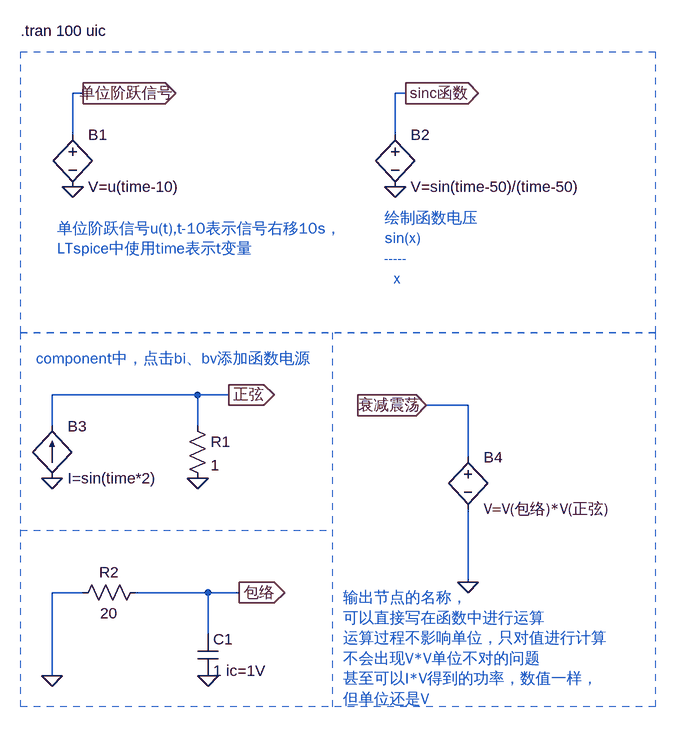
[diagram p0: schematic 08.BVBI函数电源.asc]
08.BVBI函数电源.asc, the LTspice schematic file:
Version 4
SHEET 1 880 1300
WIRE -224 352 -240 352
WIRE 272 352 256 352
WIRE -240 416 -240 352
WIRE 256 416 256 352
WIRE -48 816 -272 816
WIRE 0 816 -48 816
WIRE 368 832 304 832
WIRE -272 864 -272 816
WIRE -48 864 -48 816
WIRE 368 912 368 832
WIRE 368 1104 368 992
WIRE -224 1120 -272 1120
WIRE -32 1120 -144 1120
WIRE 16 1120 -32 1120
WIRE -32 1184 -32 1120
WIRE -272 1248 -272 1120
FLAG -240 496 0
FLAG -224 352 单位阶跃信号
IOPIN -224 352 Out
FLAG 256 496 0
FLAG 272 352 sinc函数
IOPIN 272 352 Out
FLAG -272 944 0
FLAG -48 944 0
FLAG 0 816 正弦
IOPIN 0 816 Out
FLAG -32 1248 0
FLAG -272 1248 0
FLAG 16 1120 包络
IOPIN 16 1120 Out
FLAG 304 832 衰减震荡
IOPIN 304 832 In
FLAG 368 1104 0
SYMBOL bv -240 400 R0
SYMATTR InstName B1
SYMATTR Value V=u(time-10)
SYMBOL bv 256 400 R0
SYMATTR InstName B2
SYMATTR Value V=sin(time-50)/(time-50)
SYMBOL bv 368 896 R0
SYMATTR InstName B4
SYMATTR Value V=V(包络)*V(正弦)
SYMBOL res -64 848 R0
SYMATTR InstName R1
SYMATTR Value 1
SYMBOL cap -48 1184 R0
SYMATTR InstName C1
SYMATTR Value 1 ic=1V
SYMBOL res -128 1104 R90
WINDOW 0 0 56 VBottom 2
WINDOW 3 32 56 VTop 2
SYMATTR InstName R2
SYMATTR Value 20
SYMBOL bi2 -272 864 R0
SYMATTR InstName B3
SYMATTR Value I=sin(time*2)
TEXT -320 256 Left 2 !.tran 100 uic
TEXT -264 560 Left 2 ;单位阶跃信号u(t),t-10表示信号右移10s，\nLTspice中使用time表示t变量
TEXT 240 544 Left 2 ;绘制函数电压\nsin(x)\n-----\n  x
TEXT 176 1128 Left 2 ;输出节点的名称，\n可以直接写在函数中进行运算\n运算过程不影响单位，只对值进行计算\n不会出现V*V单位不对的问题\n甚至可以I*V得到的功率，数值一样，\n但单位还是V
TEXT -296 760 Left 2 ;component中，点击bi、bv添加函数电源
LINE Normal 160 1296 160 720 2
LINE Normal -320 1024 160 1024 2
LINE Normal -320 1024 -320 1024 2
RECTANGLE Normal 656 720 -320 288 2
RECTANGLE Normal 656 1296 -320 720 2

The netlist it stands for:
* 08.BVBI函数电源.asc
B1 单位阶跃信号 0 V=u(time-10)
B2 sinc函数 0 V=sin(time-50)/(time-50)
B4 衰减震荡 0 V=V(包络)*V(正弦)
R1 正弦 0 1
C1 包络 0 1 ic=1V
R2 包络 0 20
B3 0 正弦 I=sin(time*2)
.tran 100 uic
* 单位阶跃信号u(t),t-10表示信号右移10s，
* LTspice中使用time表示t变量
* 绘制函数电压
* sin(x)
* -----
*   x
* 输出节点的名称，
* 可以直接写在函数中进行运算
* 运算过程不影响单位，只对值进行计算
* 不会出现V*V单位不对的问题
* 甚至可以I*V得到的功率，数值一样，
* 但单位还是V
* component中，点击bi、bv添加函数电源
.backanno
.end